# EAGLE schematic ExenMiniLighthouseShield (EAGLE 9.1.0)
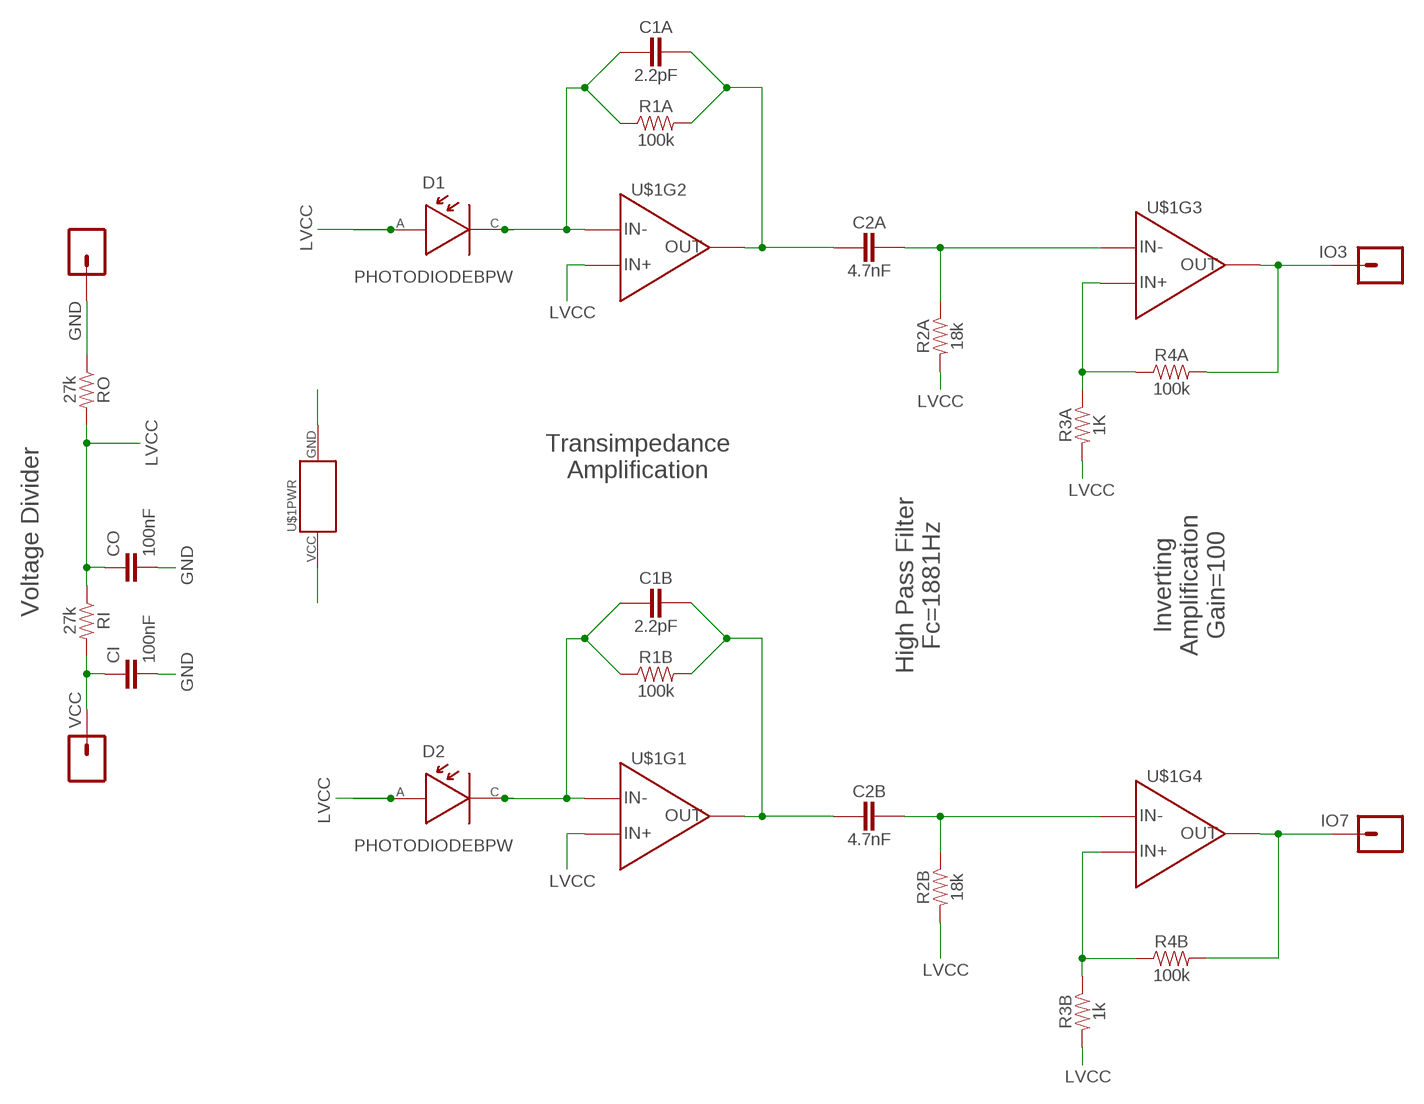
[diagram p0: schematic, sheet 1]

## Parts
C1A  2.2pF  CAPACITOR  [PASSIVE-0603]
C1B  2.2pF  CAPACITOR  [PASSIVE-0603]
C2A  4.7nF  CAPACITOR  [PASSIVE-0603]
C2B  4.7nF  CAPACITOR  [PASSIVE-0603]
CI  100nF  4.7PF-0603-50V-5%  [0603]
CO  100nF  4.7PF-0603-50V-5%  [0603]
D1  PHOTODIODEBPW  [BPW34_BP104_SMD]
D2  PHOTODIODEBPW  [BPW34_BP104_SMD]
GND  SINGLE-THROUGH-HOLE  [SINGLE-THROUGH-HOLE]
IO3  CONN_01PTH_NO_SILK_YES_STOP  [1X01_NO_SILK]
IO7  CONN_01PTH_NO_SILK_YES_STOP  [1X01_NO_SILK]
R1A  100k  RESISTOR  [PASSIVE-0603]
R1B  100k  RESISTOR  [PASSIVE-0603]
R2A  18k  RESISTOR  [PASSIVE-0603]
R2B  18k  RESISTOR  [PASSIVE-0603]
R3A  1K  RESISTOR  [PASSIVE-0603]
R3B  1k  RESISTOR  [PASSIVE-0603]
R4A  100k  RESISTOR  [PASSIVE-0603]
R4B  100k  RESISTOR  [PASSIVE-0603]
RI  27k  100KOHM-0603-1/10W-1%  [0603]
RO  27k  100KOHM-0603-1/10W-1%  [0603]
U$1  TLV2464IPW  [PW14]
VCC  CONN_01PTH_NO_SILK_YES_STOP  [1X01_NO_SILK]

## Nets
D1IN: C1B.1 D2.CATHODE R1B.1 U$1.2(IN-)
D1OA2P: C2B.2 R2B.1 U$1.13(IN-)
D1OAOUT1: C1B.2 C2B.1 R1B.2 U$1.1(OUT)
D2IN: C1A.1 D1.CATHODE R1A.1 U$1.6(IN-)
D2OA1OUT: C1A.2 C2A.1 R1A.2 U$1.7(OUT)
D2OA2N: R3A.1 R4A.1 U$1.10(IN+)
D2OA2P: C2A.2 R2A.1 U$1.9(IN-)
GND: CI.2 CO.2 GND.1 RO.1 U$1.11(PWR:GND)
IO3: IO3.1 R4A.2 U$1.8(OUT)
IO7: IO7.1 R4B.2 U$1.14(OUT)
LVCC: CO.1 D1.ANODE D2.ANODE R2A.2 R2B.2 R3A.2 R3B.2 RI.1 RO.2 U$1.3(IN+) U$1.5(IN+)
N$11: R3B.1 R4B.1 U$1.12(IN+)
VCC: CI.1 RI.2 U$1.4(PWR:VCC) VCC.1

## Notes on the sheet
- Transimpedance
  Amplification
- Voltage Divider
- High Pass Filter
  Fc=1881Hz
- Inverting
  Amplification
  Gain=100

## Library data of the parts
C1A C1B C2A C2B = ZippyComponentLibrary:CAPACITOR
CI CO = SparkFun-Capacitors:4.7PF: 4.7pF ceramic capacitors A capacitor is a passive two-terminal electrical component used to store electrical energy temporarily in an electric field.; PROD_ID: CAP-07880; VALUE: 4.7pF
D1 D2 = ZippyComponentLibrary:PHOTODIODE: "2x1 SMD Mounting Point For BPW34 Diode"
GND = ZippyComponentLibrary:SINGLE-THROUGH-HOLE
IO3 IO7 VCC = SparkFun-Connectors:CONN_01: Single connection point. Often used as Generic Header-pin footprint for 0.1 inch spaced/style header connections On any of the 0.1 inch spaced packages, you can populate with these: Break Away Headers - Straight <https://www.sparkfun.com/products/116> (PRT-00116) Break Away Male Headers - Right Angle <https://www.sparkfun.com/products/553> (PRT-00553) Female Headers <https://www.sparkfun.com/products/115> (PRT-00115) Break Away Headers - Machine Pin <https://www.sparkfun.com/products/117> (PRT-00117) Break Away Female Headers - Swiss Machine Pin <https://www.sparkfun.com/products/743> (PRT-00743) This device is also useful as a general connection point to wire up your design to another part of your project. Our various solder wires solder well into these plated through hole pads. Hook-Up Wire - Assortment (Stranded, 22 AWG) <https://www.sparkfun.com/products/11375> (PRT-11375) Hook-Up Wire - Assortment (Solid Core, 22 AWG) <https://www.sparkfun.com/products/11367> (PRT-11367) View the entire wire category on our website here <https://www.sparkfun.com/categories/141> Special notes: SMTSO-256-ET is a "flush mount" nut for a 4-40 screw. We mostly use this on specialty testbeds; it is a nice way to connect hardware to your PCB at an adjustable hieght. Also note, the SNAP packages are for using a snappable style connector. We sell a baggie of snaps and they are also used on two LilyPad designs: Snap Assortment - 30 pack (male and female) <https://www.sparkfun.com/products/11347> (DEV-11347) LilyPad Arduino SimpleSnap <https://www.sparkfun.com/products/10941> (DEV-10941) LilyPad SimpleSnap Protoboard <https://www.sparkfun.com/products/10940> (DEV-10940)
R1A R1B R2A R2B R3A R3B R4A R4B = ZippyComponentLibrary:RESISTOR
RI RO = SparkFun-Resistors:100KOHM: 100kΩ resistor A resistor is a passive two-terminal electrical component that implements electrical resistance as a circuit element. Resistors act to reduce current flow, and, at the same time, act to lower voltage levels within circuits. - Wikipedia; PROD_ID: RES-07828; VALUE: 100k
U$1 = ZippyComponentLibrary:TLV2464